# EAGLE design PowerRegulator28V (EAGLE 5.10)
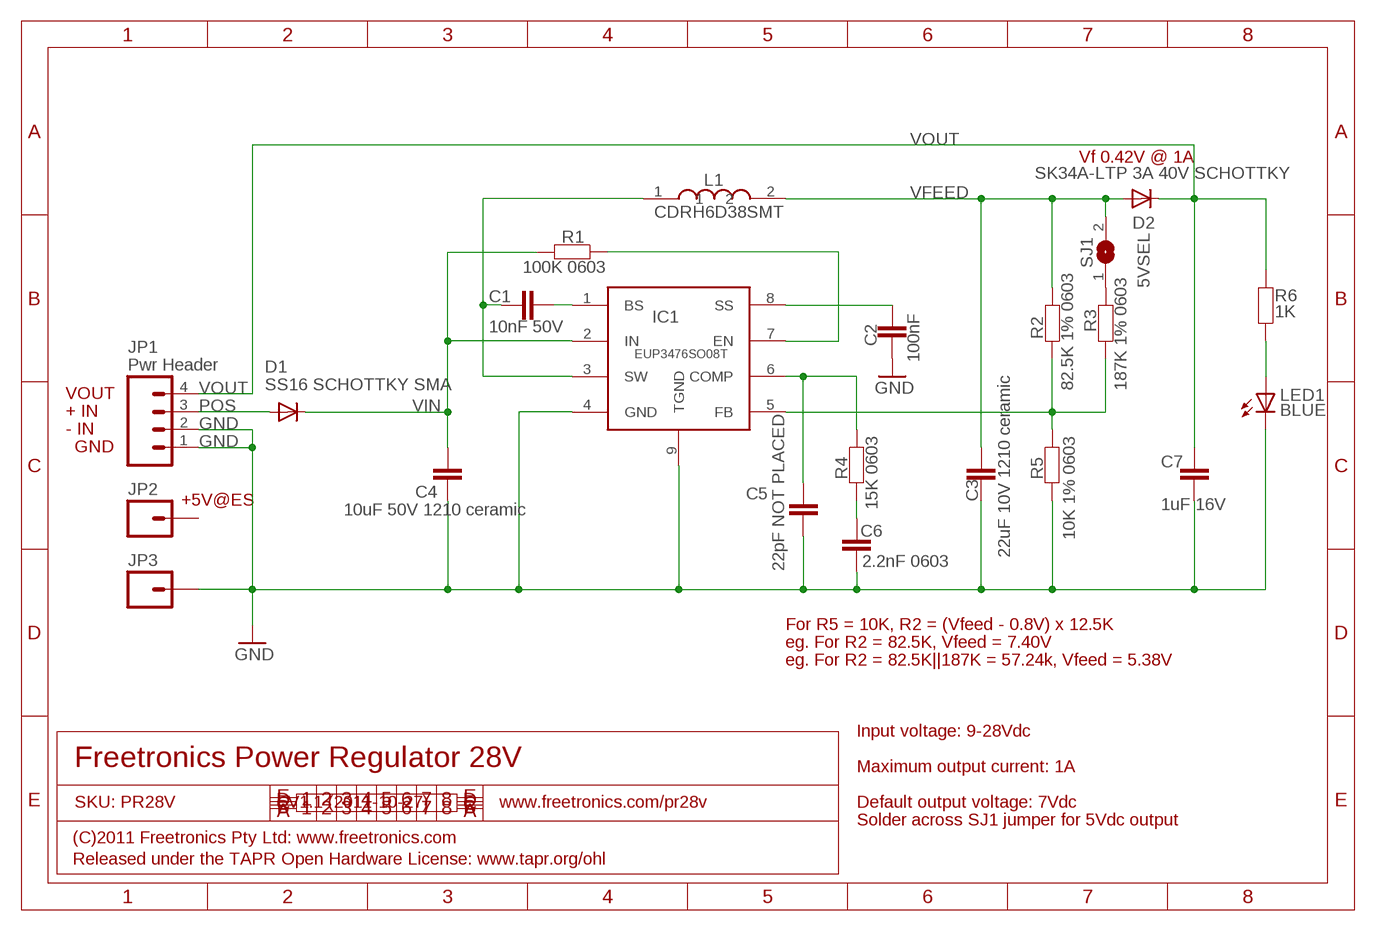
[diagram p0: schematic, sheet 1]

## Parts
C1  10nF 50V  CAP0603  [0603]
C2  100nF  CAP0603  [0603]
C3  22uF 10V 1210 ceramic  C-EUC1210  [C1210]
C4  10uF 50V 1210 ceramic  C-EUC1210  [C1210]
C5  22pF NOT PLACED  CAP0603  [0603]
C6  2.2nF 0603  CAP0603  [0603]
C7  1uF 16V  CAP0603  [0603]
D1  SS16 SCHOTTKY SMA  DIODESMAB  [SMA-SMB-DIODE]
D2  SK34A-LTP 3A 40V SCHOTTKY  DIODESMA  [SMA-DIODE]
IC1  EUP3476SO08T  [SO08T]
JP1  Pwr Header  M04PTH  [1X04]
JP2  M01PTH  [1X01]
JP3  M01PTH  [1X01]
L1  CDRH6D38SMT  [CDRH]
LED1  BLUE  LED0603  [LED-0603]
R1  100K 0603  RESISTOR0603  [0603]
R2  82.5K 1% 0603  RESISTOR0603  [0603]
R3  187K 1% 0603  RESISTOR0603  [0603]
R4  15K 0603  RESISTOR0603  [0603]
R5  10K 1% 0603  RESISTOR0603  [0603]
R6  1K  RESISTOR0603  [0603]
SJ1  5VSEL  SJ  [SJ]

## Nets
GND: C2.1 C3.2 C4.2 C5.2 C6.2 C7.2 IC1.4(GND) IC1.9(TGND) JP1.1 JP1.2 JP3.1 LED1.C R5.1
N$1: R3.1 SJ1.1
N$64: IC1.7(EN) R1.1
N$66: IC1.5(FB) R2.2 R3.2 R5.2
N$71: C5.1 IC1.6(COMP) R4.2
N$72: C6.1 R4.1
N$73: C1.2 IC1.1(BS)
N$77: C2.2 IC1.8(SS)
N$78: C1.1 IC1.3(SW) L1.1
N$131: LED1.A R6.2
POS: D1.A JP1.3
VFEED: C3.1 D2.A L1.2 R2.1 SJ1.2
VIN: C4.1 D1.C IC1.2(IN) R1.2
VOUT: C7.1 D2.C JP1.4 R6.1
Unconnected: JP2.1

## Notes on the sheet
- Vf 0.42V @ 1A
- VOUT
- + IN
- - IN
- GND
- +5V@ES
- For R5 = 10K, R2 = (Vfeed - 0.8V) x 12.5K
- eg. For R2 = 82.5K, Vfeed = 7.40V
- eg. For R2 = 82.5K||187K = 57.24k, Vfeed = 5.38V
- Input voltage: 9-28Vdc
- Freetronics Power Regulator 28V
- Maximum output current: 1A
- SKU: PR28V | V1.1 (2011-10-27) | www.freetronics.com/pr28v | Default output voltage: 7Vdc
- Solder across SJ1 jumper for 5Vdc output
- (C)2011 Freetronics Pty Ltd: www.freetronics.com
- Released under the TAPR Open Hardware License: www.tapr.org/ohl

## Library data of the parts
C1 C2 C5 C6 = freetronics-marc:CAP: Capacitor Standard 0603 ceramic capacitor, and 0.1" leaded capacitor.
C3 C4 = freetronics-jon:C-EU: CAPACITOR, European symbol
C7 = freetronics:CAP: Capacitor Standard 0603 ceramic capacitor, and 0.1" leaded capacitor.
D1 = freetronics-jon:DIODE: Diode These are standard reverse protection diodes and small signal diodes. SMA package can handle up to about 1A. SOD-323 can handle about 200mA. What the SOD-323 package when ordering, there are some mfgs out there that are 5-pin packages.
D2 = freetronics-master-v1:DIODE: Diode These are standard reverse protection diodes and small signal diodes. SMA package can handle up to about 1A. SOD-323 can handle about 200mA. What the SOD-323 package when ordering, there are some mfgs out there that are 5-pin packages.
IC1 = freetronics-jon:EUP3476
JP1 = freetronics:M04: Header 4 Standard 4-pin 0.1" header. Use with straight break away headers (SKU : PRT-00116), right angle break away headers (PRT-00553), swiss pins (PRT-00743), machine pins (PRT-00117), and female headers (PRT-00115). Molex polarized connector foot print use with SKU : PRT-08231 with associated crimp pins and housings.
JP2 JP3 = freetronics:M01: Header 1 Standard 1-pin 0.1" header. Use with straight break away headers (SKU : PRT-00116), right angle break away headers (PRT-00553), swiss pins (PRT-00743), machine pins (PRT-00117), and female headers (PRT-00115).
L1 = freetronics-jon:CDRH6D38: Inductor
LED1 = freetronics:LED: LEDs Standard schematic elements and footprints for 5mm, 3mm, 1206, and 0603 sized LEDs. 5mm - Spark Fun Electronics SKU : COM-00529 (and others)
R1-R5 = freetronics-marc:RESISTOR: Resistor Basic schematic elements and footprints for 0603, 1206, and PTH 1/10th watt (small) resistors.
R6 = freetronics:RESISTOR: Resistor Basic schematic elements and footprints for 0603, 1206, and PTH 1/10th watt (small) resistors.
SJ1 = freetronics-master-v1:SJ: SMD solder JUMPER

## Board
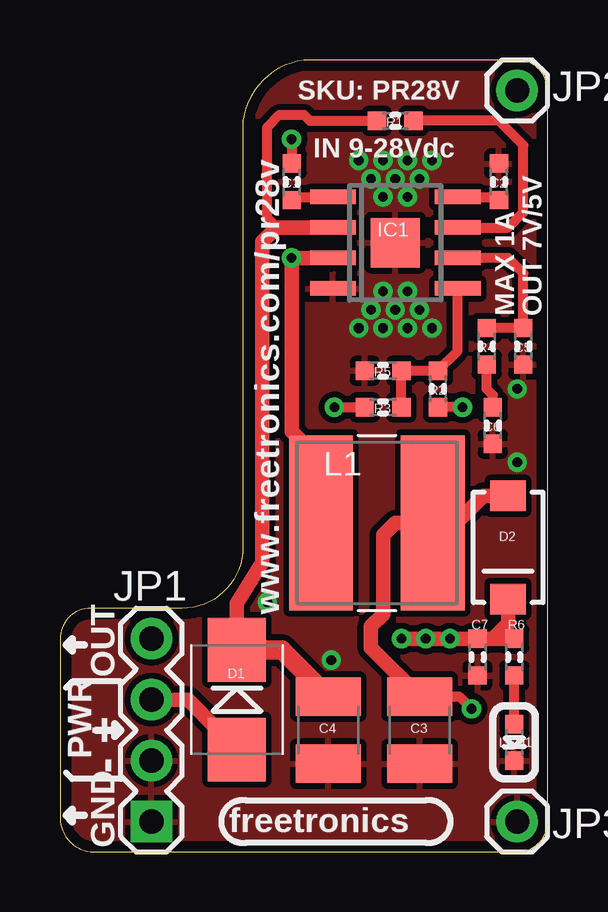
[diagram p1: board, top side]
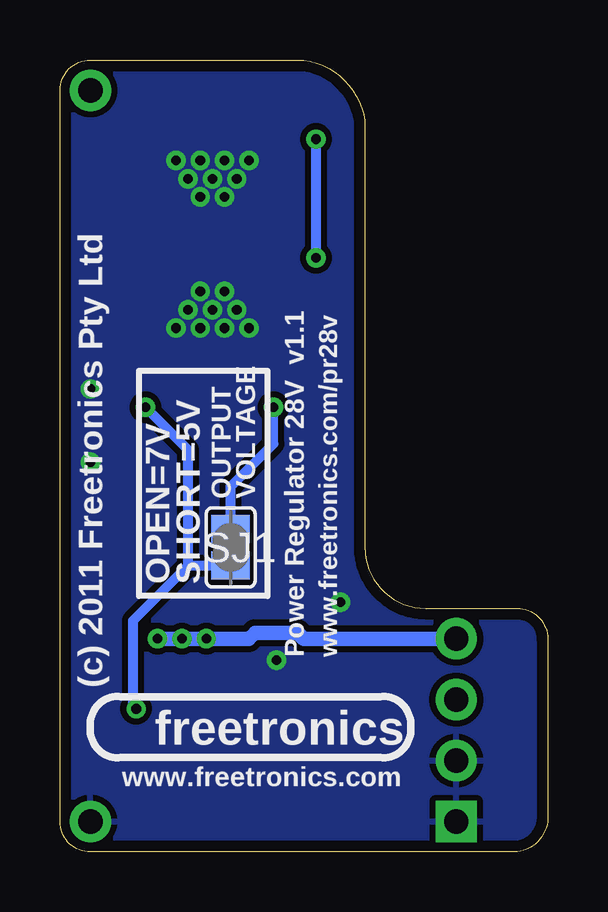
[diagram p2: board, bottom side, seen from below]

Size 20.32 x 33.02 mm. Coordinates in mm from the lower left corner, seen from the top.
Outline: 0,1.27 arc74 1.27,0 19.05,0 arc90 20.32,1.27 20.32,31.75 arc90 19.05,33.02 10.16,33.02 arc74 7.62,30.48 7.62,12.7 arc-90 5.08,10.16 1.27,10.16 arc90 0,8.89 0,1.27
Copper layers (1*16): Top 0.035mm / dielectric 1.5mm / Bottom 0.035mm
Design rules "default *": minimum track width 10mil, minimum drill 15mil, track to track 10mil, track to pad 10mil, pad to pad 10mil, via to via 10mil, smd to smd 8mil, copper to edge 18mil, drill to drill 8mil, minimum pad ring 14mil, minimum via ring 8mil, stop-mask expansion 4mil, vias tented up to drill 25mil, thermal gap 10mil

### Footprints (pad centres in the part's own frame; a part is rotated, then mirrored left to right if it is on the bottom)
0603 = smd 0.762 x 0.762: 1 -0.762,0; 2 0.762,0
C1210 = smd 1.6 x 2.7: 1 -1.4,0; 2 1.4,0
SMA-SMB-DIODE = smd 2.65 x 2.4: A 2.075,0; C -2.075,0
SMA-DIODE = smd 1.27 x 1.47: A -2.15,0; C 2.15,0
SO08T = smd 1.905 x 0.6: 1 -2.6,1.905; 2 -2.6,0.635; 3 -2.6,-0.635; 4 -2.6,-1.905; 5 2.6,-1.905; 6 2.6,-0.635; 7 2.6,0.635; 8 2.6,1.905 | smd 2.057 x 2.057: 9 0,0
1X04 = drill 1.016 square: 1 0,0 | drill 1.016: 2 2.54,0; 3 5.08,0; 4 7.62,0
1X01 = drill 1.016: 1 0,0
CDRH = smd 7.3 x 2.65: 1 0,2.325; 2 0,-2.325
LED-0603 = smd 0.762 x 0.762: A -0.762,0; C 0.762,0
SJ = smd 1.168 x 1.6: 1 -0.762,0; 2 0.762,0

### Placement (x,y rotation side)
C1  9.65,27.94 270 top
C2  18.29,27.94 270 top
C3  14.99,5.08 270 top
C4  11.18,5.08 270 top
C5  19.3,21.08 270 top
C6  18.03,17.78 270 top
C7  17.4,8.13 270 top
D1  7.37,6.35 270 top
D2  18.67,12.7 270 top
IC1  13.97,25.4 0 top
JP1  3.81,1.27 90 top
JP2  19.05,31.75 0 top
JP3  19.05,1.27 0 top
L1  13.21,13.72 90 top
LED1  18.92,4.57 270 top
R1  13.97,30.48 180 top
R2  15.75,19.3 90 top
R3  13.46,18.54 0 top
R4  17.78,21.08 90 top
R5  13.46,20.07 0 top
R6  18.92,8.13 270 top
SJ1  13.21,12.7 270 bottom

### Tracks (layer width: path | path; a pad name or v marks a point on that pad's centre or on a via)
GND  (via drill 0.4, 0.4 pad 0.4)
  other vias: 13.97,22.61 13.46,27.3 14.48,27.3 14.48,23.37 13.46,28.83 19.05,16.26 12.95,22.61 12.45,28.83 14.48,28.83 19.05,19.3 14.99,22.61 15.49,21.84 13.46,21.84 14.48,21.84 12.45,21.84 13.46,23.37 15.49,28.83 13.97,28.07 14.99,28.07 12.95,28.07 8.64,10.41 11.3,8
  pour Top: 1.27,0 arc-90 0,1.27 0,8.89 arc-90 1.27,10.16 5.08,10.16 arc90 7.62,12.7 7.62,30.48 arc-90 10.16,33.02 19.05,33.02 arc-90 20.32,31.75 20.32,1.27 arc-90 19.05,0
  pour Bottom: 0,1.27 0,8.89 arc-90 1.27,10.16 5.08,10.16 arc90 7.62,12.7 7.62,30.48 arc-90 10.16,33.02 19.05,33.02 arc-90 20.32,31.75 20.32,1.27 arc-90 19.05,0 1.27,0 arc-90
N$1  (via drill 0.4)
  Top 0.406: v11.43,18.54 R3.1
  Bottom 0.406: SJ1.1 13.21,15.24 11.43,17.02 v11.43,18.54
N$64
  Top 0.406: IC1.7 18.67,26.04 19.3,26.67 19.3,29.46 18.29,30.48 R1.1
N$66
  Top 0.406: R3.2 R5.2 R2.2 16.57,20.89 IC1.5
N$71
  Top 0.406: R4.2 C5.1 19.3,24.13 18.67,24.77 IC1.6
N$72
  Top 0.406: C6.1 18.03,19.05 17.78,19.3 R4.1
N$73
  Top 0.406: IC1.1 9.78,27.3 C1.2
N$77
  Top 0.406: IC1.8 17.91,27.3 C2.2
N$78  (via drill 0.4 pad 0.4)
  Top 0.406: 11.18,16 11.14,14.19 L1.1 | v9.65,29.72 C1.1
  Top 0.61: 11.18,16 9.65,17.53 v9.65,24.77 IC1.3
  Bottom 0.406: v9.65,24.77 v9.65,29.72
N$131
  Top 0.406: LED1.A R6.2
POS
  Top 0.61: JP1.3 5.33,6.35 6.6,5.08 D1.A
VFEED  (via drill 0.4)
  Top 0.406: 14.6,6.6 C3.1 16.63,6.48 v17.14,5.97 | L1.2 15.75,13.93 | v16.76,18.54 R2.1
  Top 0.61: C3.1 12.95,8.51 12.95,9.4 13.46,9.91 13.46,13.21 13.97,13.72 L1.2 16.51,13.72 17.64,14.85 D2.A
  Bottom 0.406: 14.99,11.94 SJ1.2 | 14.99,11.94 14.99,16.76 v16.76,18.54 | 14.99,11.94 17.27,9.65 17.27,6.1 v17.14,5.97
VIN
  Top 0.406: R1.2 10.41,30.48 10.16,30.73 9.14,30.73 8.64,30.23 8.64,26.42 9.02,26.04
  Top 0.61: 7.37,8.3 D1.C 7.37,10.36 8.43,12.06 8.43,25.45 9.02,26.04 IC1.2
  Top 0.813: D1.C 9.23,8.42 C4.1
VOUT  (via drill 0.4)
  Top 0.406: 18.03,8.89 C7.1
  Top 0.61: v15.24,8.89 v14.22,8.89 | v15.24,8.89 v16.26,8.89 18.03,8.89 | v15.24,8.89 14.99,8.89 | 18.03,8.89 R6.1 | D2.C 18.67,9.53 18.03,8.89
  Bottom 0.61: JP1.4 10.16,8.89 10.41,9.14 12.19,9.14 12.45,8.89 v15.24,8.89 v16.26,8.89

### Text on the board
tPlace: SKU: PR28V | IN 9-28Vdc | MAX 1A | OUT 7V/5V | www.freetronics.com/pr28v | OUT | PWR | - + | freetronics | GND
bPlace: VOLTAGE | OUTPUT | SHORT=5V | OPEN=7V | www.freetronics.com/pr28v | Power Regulator 28V v1.1 | (c) 2011 Freetronics Pty Ltd | freetronics | www.freetronics.com